# EAGLE board axoloti core v3 (EAGLE 6.2), part 1 of 2
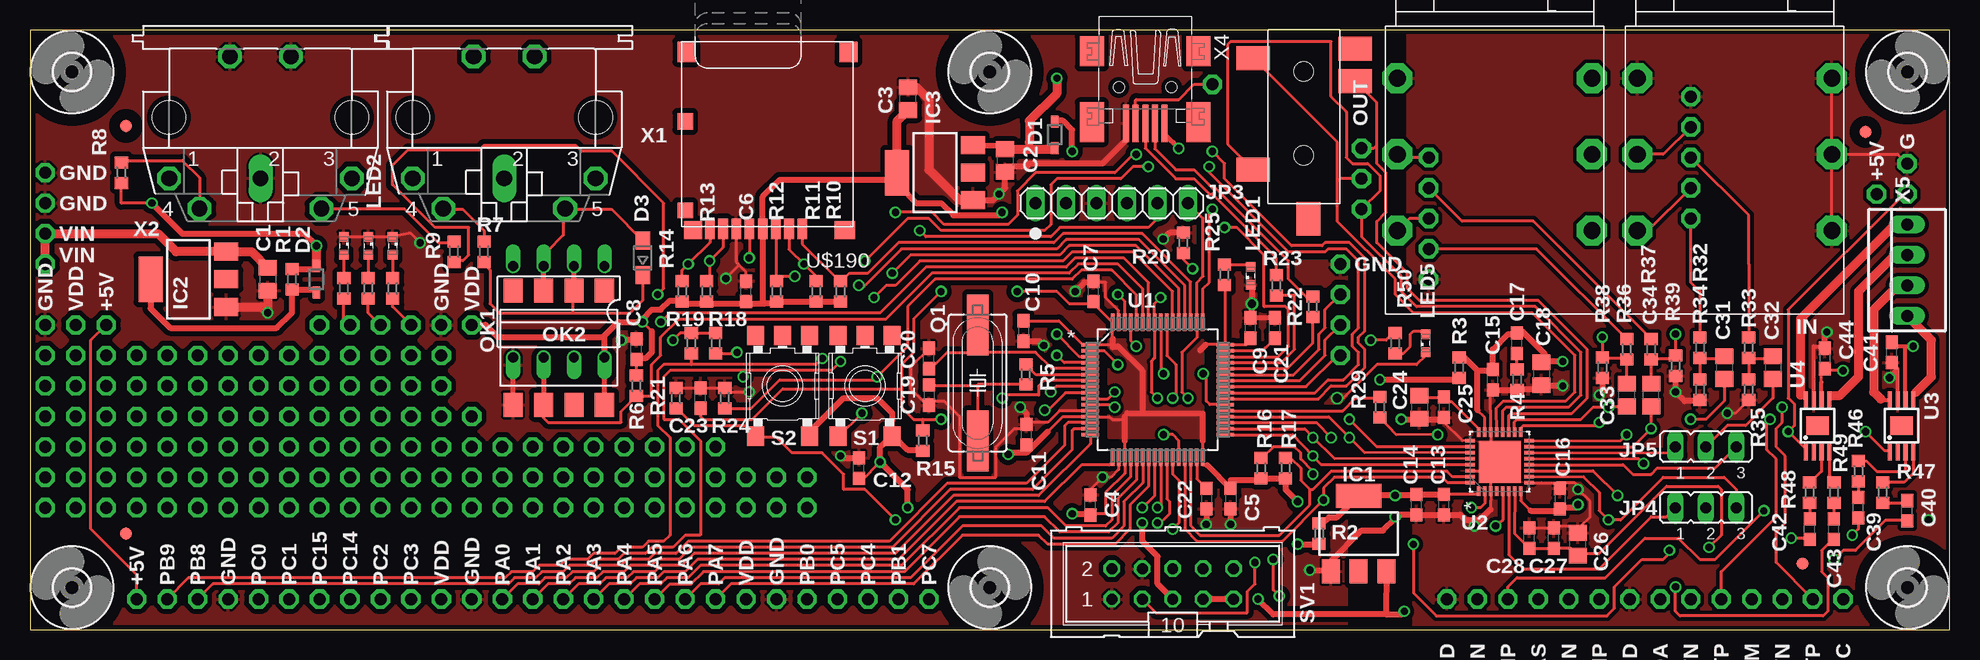
[diagram p5: board, top side]
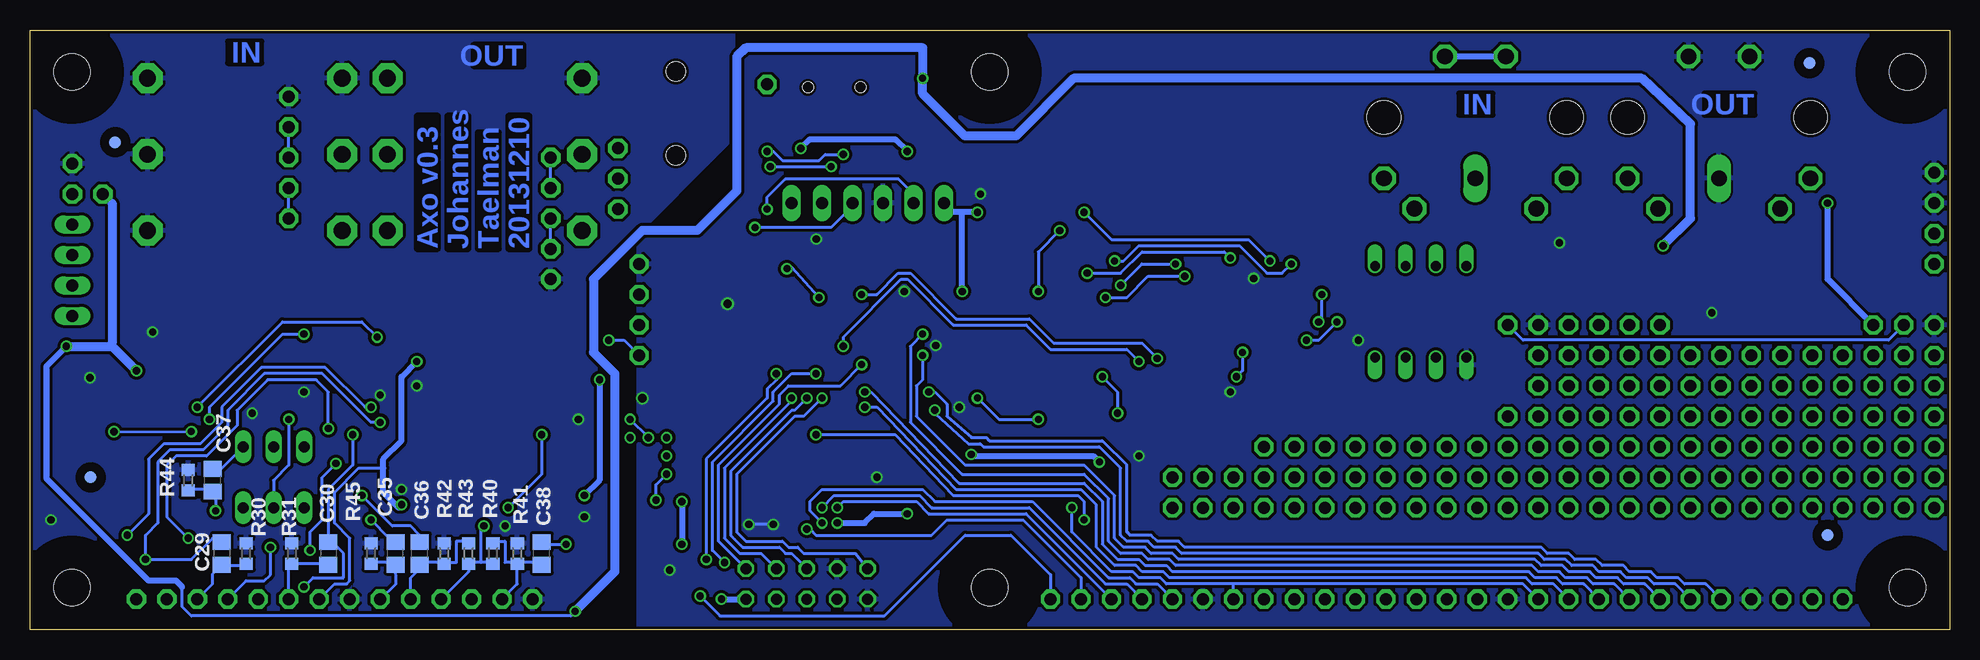
[diagram p6: board, bottom side, seen from below]

Size 160 x 50 mm. Coordinates in mm from the lower left corner, seen from the top.
Outline: 160,0 160,50 0,50 0,0 160,0
Copper layers (1*16): Top 0.018mm / dielectric 1.55mm / Bottom 0.018mm
Design rules: minimum track width 0.15mm, minimum drill 0.35mm, track to track 0.15mm, track to pad 0.15mm, pad to pad 0.15mm, via to via 0.15mm, smd to smd 0mil, copper to edge 0.25mm, drill to drill 0.35mm, minimum pad ring 0.175mm, minimum via ring 0.125mm, stop-mask expansion 0mil, vias tented up to drill 0.45mm, thermal gap 0.2mm

## Footprints (pad centres in the part's own frame; a part is rotated, then mirrored left to right if it is on the bottom)
C0805 = smd 1.3 x 1.5: 1 -0.95,0; 2 0.95,0
C0603 = smd 1.1 x 1: 1 -0.85,0; 2 0.85,0
SOD323 = smd 1 x 0.6: 1 -1.1,0; 2 1.1,0
SOD323-W = smd 1.5 x 1.2: A 1.45,0; C -1.45,0
3,0 = hole 3: 0,0
SOT223 = smd 1.5 x 2: 1 -2.3,-3.15; 2 0,-3.15; 3 2.3,-3.15 | smd 3.8 x 2: 4 0,3.15
1X06 = drill 1.016 long: 1 -6.35,0; 2 -3.81,0; 3 -1.27,0; 4 1.27,0; 5 3.81,0; 6 6.35,0
JP2 = drill 0.914 long: 1 -2.54,0; 2 0,0; 3 2.54,0
SML0603 = smd 0.8 x 0.8: A 0.75,0; C -0.75,0
DIL08 = drill 0.813 offset: 1 -3.81,-3.81; 2 -1.27,-3.81; 3 1.27,-3.81; 4 3.81,-3.81; 5 3.81,3.81; 6 1.27,3.81; 7 -1.27,3.81; 8 -3.81,3.81
DIL8-SMD = smd 1.6 x 2: 1 -3.81,-4.77; 2 -1.27,-4.77; 3 1.27,-4.77; 4 3.81,-4.77; 5 3.81,4.77; 6 1.27,4.77; 7 -1.27,4.77; 8 -3.81,4.77
SM49 = smd 5.08 x 1.778: 1 -4.826,0; 2 4.826,0
R0603 = smd 1 x 1.1: 1 -0.85,0; 2 0.85,0
SKHMPXE010 = smd 1.6 x 1.4: 1 -4.2,2.25; 2 4.2,2.25; 3 -4.2,-2.25; 4 4.2,-2.25; 5 4.2,0
ML10 = drill 0.914 octagon: 1 -5.08,-1.27; 2 -5.08,1.27; 3 -2.54,-1.27; 4 -2.54,1.27; 5 0,-1.27; 6 0,1.27; 7 2.54,-1.27; 8 2.54,1.27; 9 5.08,-1.27; 10 5.08,1.27
QFP50P1200X1200X160-64N = smd 1.473 x 0.279: 1 -5.613,3.759; 2 -5.613,3.251; 3 -5.613,2.743; 4 -5.613,2.261; 5 -5.613,1.753; 6 -5.613,1.245; 7 -5.613,0.762; 8 -5.613,0.254; 9 -5.613,-0.254; 10 -5.613,-0.762; 11 -5.613,-1.245; 12 -5.613,-1.753; 13 -5.613,-2.261; 14 -5.613,-2.743; 15 -5.613,-3.251; 16 -5.613,-3.759; 33 5.613,-3.759; 34 5.613,-3.251; 35 5.613,-2.743; 36 5.613,-2.261; 37 5.613,-1.753; 38 5.613,-1.245; 39 5.613,-0.762; 40 5.613,-0.254; 41 5.613,0.254; 42 5.613,0.762; 43 5.613,1.245; 44 5.613,1.753; 45 5.613,2.261; 46 5.613,2.743; 47 5.613,3.251; 48 5.613,3.759 | smd 0.279 x 1.473: 17 -3.759,-5.613; 18 -3.251,-5.613; 19 -2.743,-5.613; 20 -2.261,-5.613; 21 -1.753,-5.613; 22 -1.245,-5.613; 23 -0.762,-5.613; 24 -0.254,-5.613; 25 0.254,-5.613; 26 0.762,-5.613; 27 1.245,-5.613; 28 1.753,-5.613; 29 2.261,-5.613; 30 2.743,-5.613; 31 3.251,-5.613; 32 3.759,-5.613; 49 3.759,5.613; 50 3.251,5.613; 51 2.743,5.613; 52 2.261,5.613; 53 1.753,5.613; 54 1.245,5.613; 55 0.762,5.613; 56 0.254,5.613; 57 -0.254,5.613; 58 -0.762,5.613; 59 -1.245,5.613; 60 -1.753,5.613; 61 -2.261,5.613; 62 -2.743,5.613; 63 -3.251,5.613; 64 -3.759,5.613
QFN50P500X500X100-33N = smd 0.813 x 0.29: 1 -2.45,1.75; 2 -2.45,1.25; 3 -2.45,0.75; 4 -2.45,0.25; 5 -2.45,-0.25; 6 -2.45,-0.75; 7 -2.45,-1.25; 8 -2.45,-1.75; 17 2.45,-1.75; 18 2.45,-1.25; 19 2.45,-0.75; 20 2.45,-0.25; 21 2.45,0.25; 22 2.45,0.75; 23 2.45,1.25; 24 2.45,1.75 | smd 0.29 x 0.813: 9 -1.75,-2.45; 10 -1.25,-2.45; 11 -0.75,-2.45; 12 -0.25,-2.45; 13 0.25,-2.45; 14 0.75,-2.45; 15 1.25,-2.45; 16 1.75,-2.45; 25 1.75,2.45; 26 1.25,2.45; 27 0.75,2.45; 28 0.25,2.45; 29 -0.25,2.45; 30 -0.75,2.45; 31 -1.25,2.45; 32 -1.75,2.45 | smd 3.5 x 3.5: 33 0,0
MSOP8 = smd 0.35 x 1.55: 1 -0.975,-2.1; 2 -0.325,-2.1; 3 0.325,-2.1; 4 0.975,-2.1; 5 0.975,2.1; 6 0.325,2.1; 7 -0.325,2.1; 8 -0.975,2.1 | smd 1.89 x 1.57: 9 0,0
PROTOHOLE_NAMED = drill 1 pad 1.6 octagon: P$1 0,0
PROTOHOLE = drill 1 pad 1.6 octagon: P$1 0,0
JACK63 = drill 1.4 pad 2.5 octagon: R -10.7,8.115; RN -10.7,-8.115; S -4.35,8.115; SN -4.35,-8.115; T -17.05,8.115; TN -17.05,-8.115
FIDUCIAL-1 = smd 1 x 1: P$1 0,0
MOLEX_502774 = smd 0.8 x 1.68: 1 -2.9,15.61; 2 -1.8,15.61; 3 -0.7,15.61; 4 0.4,15.61; 5 1.5,15.61; 6 2.6,15.61; 7 3.7,15.61; 8 4.8,15.61 | smd 1.7 x 1.5: 10 -6.45,15.7 | smd 1.5 x 1.7: 11 6.75,0.85; 12 -6.75,0.85 | smd 1.5 x 1.5: 15 6.2,15.7 | smd 1.29 x 1.3: CD1 6.855,14.05 | smd 1.29 x 1.4: CD2 6.855,6.65
35RASMT4BHNTR = smd 2 x 2.8: P1 2.4,-4.2; P2 4.3,4.3; P3 11.7,-4.2; P4 1.6,4.3 | smd 2.8 x 2: P5 15.8,0.4 | hole 1.6: 3.5,0; 10.5,0
MAB5SH = drill 1.321 octagon: 1 7.62,5.08; 3 -7.62,5.08; 4 5.08,7.62; 5 -5.08,7.62; PE -2.54,-5.08; PE@ 2.54,-5.08 | drill 1.321 long: 2 0,5.08 | hole 2.794: 7.62,0; -7.62,0
32005-301 = smd 3.1 x 0.5: 1 3,1.6; 2 3,0.8; 3 3,0; 4 3,-0.8; 5 3,-1.6 | smd 2.5 x 2: M1 -3,-4.45; M2 -3,4.45 | smd 3.3 x 2: M3 2.9,4.45; M4 2.9,-4.45 | hole 0.9: 0,2.2; 0,-2.2
22-23-2041 = drill 1 long: 1 -3.81,0; 2 -1.27,0; 3 1.27,0; 4 3.81,0

## Placement (x,y rotation side)
C1  10u  [C0805]  19.81,29.21 270 top
C2  10u  [C0805]  81.28,39.12 270 top
C3  10u  [C0805]  73.19,44.26 90 top
C4  100n  [C0603]  88.39,10.39 90 top
C5  100n  [C0603]  100.08,10.92 270 top
C6  100n  [C0603]  59.69,28.19 90 top
C7  100n  [C0603]  88.65,28.19 90 top
C8  100n  [C0603]  50.55,23.37 90 top
C9  100n  [C0603]  101.73,25.15 90 top
C10  100n  [C0603]  82.8,24.89 270 top
C11  100n  [C0603]  83.06,16.26 90 top
C12  100n  [C0603]  69.09,13.46 90 top
C13  100n  [C0603]  117.86,10.41 90 top
C14  100n  [C0603]  115.57,10.41 90 top
C15  100n  [C0603]  121.92,20.83 90 top
C16  100n  [C0603]  127.51,10.92 270 top
C17  9.1p  [C0603]  123.95,23.88 90 top
C18  10u  [C0805]  125.98,21.34 270 top
C19  27p  [C0603]  74.93,19.56 270 top
C20  27p  [C0603]  74.93,22.61 90 top
C21  2u2  [C0603]  103.76,25.15 90 top
C22  2u2  [C0603]  98.04,10.92 270 top
C23  100n  [C0603]  55.88,19.3 90 top
C24  10u  [C0805]  115.82,18.54 270 top
C25  100n  [C0603]  117.86,18.54 270 top
C26  10u  [C0805]  129.03,7.11 90 top
C27  100n  [C0603]  127,7.62 90 top
C28  100n  [C0603]  124.97,7.62 90 top
C29  NC  [C0805]  144.02,6.35 270 bottom
C30  NC  [C0805]  135.13,6.35 270 bottom
C31  10u  [C0805]  141.22,21.84 270 top
C32  10u  [C0805]  145.29,21.84 270 top
C33  10u  [C0805]  133.1,19.56 90 top
C34  10u  [C0805]  135.13,19.56 90 top
C35  NC  [C0805]  129.54,6.35 90 bottom
C36  NC  [C0805]  127.51,6.35 90 bottom
C37  NC  [C0805]  144.78,12.45 90 bottom
C38  NC  [C0805]  117.35,6.35 90 bottom
C39  NC  [C0603]  152.4,10.16 90 top
C40  NC  [C0603]  156.46,9.91 90 top
C41  NC  [C0603]  155.19,23.11 90 top
C42  NC  [C0603]  148.34,8.38 90 top
C43  NC  [C0603]  150.37,8.38 90 top
C44  NC  [C0603]  149.61,22.61 270 top
D1  schottky 500mA  [SOD323]  85.42,41.26 90 top
D2  schottky 500mA  [SOD323]  23.88,29.21 270 top
D3  1N4148  [SOD323-W]  51.07,31 90 top
H1  MOUNT-HOLE3.0  [3,0]  3.5,3.5 90 top
H2  MOUNT-HOLE3.0  [3,0]  3.5,46.5 90 top
H3  MOUNT-HOLE3.0  [3,0]  80,46.5 90 top
H4  MOUNT-HOLE3.0  [3,0]  156.5,3.5 90 top
H5  MOUNT-HOLE3.0  [3,0]  80,3.5 0 top
H6  MOUNT-HOLE3.0  [3,0]  156.5,46.5 0 top
IC1  LD117AS33TR  [SOT223]  110.74,8 0 top
IC2  LD117AS50TR  [SOT223]  13.21,29.21 90 top
IC3  LD117AS33TR  [SOT223]  75.44,38.1 90 top
JP3  [1X06]  90.17,35.56 0 top
JP4  [JP2]  139.7,10.16 0 top
JP5  [JP2]  139.7,15.24 0 top
LED1  [SML0603]  101.77,29.5 90 top
LED2  [SML0603]  30.23,32 270 top
LED3  [SML0603]  28.19,32 270 top
LED4  [SML0603]  26.16,32 270 top
LED5  [SML0603]  116.33,23.88 90 top
OK1  6N137  [DIL08]  44.07,26.5 180 top
OK2  6N137SMD  [DIL8-SMD]  44.07,23.5 180 top
Q1  [SM49]  78.99,20.57 90 top
R1  0  [R0603]  21.84,29.21 270 top
R2  NC  [R0603]  107.44,8 270 top
R3  0  [R0603]  119.13,21.84 270 top
R4  1.2nH  [R0603]  123.95,20.83 270 top
R5  220  [R0603]  83.02,21.27 90 top
R6  NC  [R0603]  50.55,20.32 270 top
R7  220  [R0603]  37.85,31.51 90 top
R8  220  [R0603]  7.62,38.1 90 top
R9  220  [R0603]  35.35,31.51 270 top
R10  47k  [R0603]  67.56,28.19 270 top
R11  47k  [R0603]  65.53,28.19 270 top
R12  47k  [R0603]  62.23,28.19 270 top
R13  47k  [R0603]  56.39,28.19 270 top
R14  47k  [R0603]  54.36,28.19 270 top
R15  nc  [R0603]  74.42,15.75 90 top
R16  4k7  [R0603]  102.62,13.46 90 top
R17  4k7  [R0603]  104.65,13.46 90 top
R18  NC  [R0603]  57.15,23.88 270 top
R19  NC  [R0603]  55.12,23.88 270 top
R20  47k  [R0603]  96.14,32.25 270 top
R21  47k  [R0603]  53.85,19.3 270 top
R22  22  [R0603]  106.93,26.92 270 top
R23  22  [R0603]  103.89,28.7 270 top
R24  47k  [R0603]  57.91,19.3 270 top
R25  220  [R0603]  99.55,29.59 90 top
R26  220  [R0603]  30.23,28.45 90 top
R27  220  [R0603]  28.19,28.45 90 top
R28  220  [R0603]  26.16,28.45 90 top
R29  50  [R0603]  112.52,18.54 90 top
R30  NC  [R0603]  141.99,6.35 270 bottom
R31  NC  [R0603]  138.18,6.35 270 bottom
R32  4k7  [R0603]  139.19,23.5 90 top
R33  4k7  [R0603]  143.25,23.5 90 top
R34  47k  [R0603]  139.19,20 90 top
R35  47k  [R0603]  143.25,20 90 top
R36  220  [R0603]  133.1,23.37 270 top
R37  220  [R0603]  135.13,23.37 270 top
R38  47k  [R0603]  131.06,21.84 90 top
R39  47k  [R0603]  137.16,22 90 top
R40  NC  [R0603]  121.41,6.35 90 bottom
R41  NC  [R0603]  119.38,6.35 270 bottom
R42  NC  [R0603]  125.48,6.35 270 bottom
R43  NC  [R0603]  123.44,6.35 90 bottom
R44  NC  [R0603]  146.81,12.45 270 bottom
R45  NC  [R0603]  131.57,6.35 270 bottom
R46  NC  [R0603]  152.4,13.21 270 top
R47  NC  [R0603]  154.43,11.43 270 top
R48  NC  [R0603]  148.34,11.43 270 top
R49  NC  [R0603]  150.37,11.43 270 top
R50  220  [R0603]  113.79,23.88 270 top
S1  SKHMPSE010  [SKHMPXE010]  69.6,20.32 90 top
S2  SKHMPSE010  [SKHMPXE010]  62.74,20.32 90 top
SV1  [ML10]  95.25,3.81 0 top
U1  STM32F405RGT6  [QFP50P1200X1200X160-64N]  94,20 0 top
U2  ADAU1961WBCPZ  [QFN50P500X500X100-33N]  122.5,14 90 top
U3  NC (TPA2005D1DRBRMSOP8)  [MSOP8]  156,17 0 top
U4  NC (TPA2005D1DRBRMSOP8)  [MSOP8]  149,17 0 top
U$1  +5V  [PROTOHOLE_NAMED]  8.89,2.54 90 top
U$2  PROTOHOLE  [PROTOHOLE]  31.75,25.4 0 top
U$3  PROTOHOLE  [PROTOHOLE]  29.21,25.4 0 top
U$4  PROTOHOLE  [PROTOHOLE]  26.67,25.4 0 top
U$5  JACK63  [JACK63]  142.09,50.33 90 top
U$6  JACK63  [JACK63]  122.09,50.33 90 top
U$7  NC  [PROTOHOLE_NAMED]  151.13,2.54 270 top
U$8  VDDA  [PROTOHOLE_NAMED]  135.89,2.54 270 top
U$9  ALOUTP  [PROTOHOLE_NAMED]  148.59,2.54 270 top
U$10  ALOUTN  [PROTOHOLE_NAMED]  146.05,2.54 270 top
U$11  CM  [PROTOHOLE_NAMED]  143.51,2.54 270 top
U$12  AROUTP  [PROTOHOLE_NAMED]  140.97,2.54 270 top
U$13  AROUTN  [PROTOHOLE_NAMED]  138.43,2.54 270 top
U$14  GND  [PROTOHOLE_NAMED]  133.35,2.54 270 top
U$15  LINP  [PROTOHOLE_NAMED]  130.81,2.54 270 top
U$16  LINN  [PROTOHOLE_NAMED]  128.27,2.54 270 top
U$17  MICBIAS  [PROTOHOLE_NAMED]  125.73,2.54 270 top
U$18  RINP  [PROTOHOLE_NAMED]  123.19,2.54 270 top
U$19  RINN  [PROTOHOLE_NAMED]  120.65,2.54 270 top
U$20  GND  [PROTOHOLE_NAMED]  118.11,2.54 270 top
U$21  PC14  [PROTOHOLE_NAMED]  26.67,2.54 90 top
U$22  PC15  [PROTOHOLE_NAMED]  24.13,2.54 90 top
U$23  PC0  [PROTOHOLE_NAMED]  19.05,2.54 90 top
U$24  PC1  [PROTOHOLE_NAMED]  21.59,2.54 90 top
U$25  PC2  [PROTOHOLE_NAMED]  29.21,2.54 90 top
U$26  PC3  [PROTOHOLE_NAMED]  31.75,2.54 90 top
U$27  PC7  [PROTOHOLE_NAMED]  74.93,2.54 90 top
U$28  PB1  [PROTOHOLE_NAMED]  72.39,2.54 90 top
U$29  PC4  [PROTOHOLE_NAMED]  69.85,2.54 90 top
U$30  PC5  [PROTOHOLE_NAMED]  67.31,2.54 90 top
U$31  PB8  [PROTOHOLE_NAMED]  13.97,2.54 90 top
U$32  PB0  [PROTOHOLE_NAMED]  64.77,2.54 90 top
U$33  PB9  [PROTOHOLE_NAMED]  11.43,2.54 90 top
U$34  GND  [PROTOHOLE_NAMED]  62.23,2.54 90 top
U$35  PA7  [PROTOHOLE_NAMED]  57.15,2.54 90 top
U$36  VDD  [PROTOHOLE_NAMED]  59.69,2.54 90 top
U$37  PA6  [PROTOHOLE_NAMED]  54.61,2.54 90 top
U$38  PA5  [PROTOHOLE_NAMED]  52.07,2.54 90 top
U$39  PA4  [PROTOHOLE_NAMED]  49.53,2.54 90 top
U$40  PA3  [PROTOHOLE_NAMED]  46.99,2.54 90 top
U$41  PA2  [PROTOHOLE_NAMED]  44.45,2.54 90 top
U$42  PA1  [PROTOHOLE_NAMED]  41.91,2.54 90 top
U$43  PA0  [PROTOHOLE_NAMED]  39.37,2.54 90 top
U$44  VDD  [PROTOHOLE_NAMED]  34.29,2.54 90 top
U$45  VDD  [PROTOHOLE_NAMED]  36.83,25.4 90 top
U$46  VDD  [PROTOHOLE_NAMED]  3.81,25.4 90 top
U$47  GND  [PROTOHOLE_NAMED]  36.83,2.54 90 top
U$48  GND  [PROTOHOLE_NAMED]  16.51,2.54 90 top
U$49  GND  [PROTOHOLE_NAMED]  34.29,25.4 90 top
U$50  +5V  [PROTOHOLE_NAMED]  6.35,25.4 90 top
U$51  GND  [PROTOHOLE_NAMED]  1.27,25.4 90 top
U$52  FIDUCIAL-1  [FIDUCIAL-1]  8,42 0 top
U$53  FIDUCIAL-1  [FIDUCIAL-1]  8,8 0 top
U$54  FIDUCIAL-1  [FIDUCIAL-1]  153,41.5 0 top
U$55  FIDUCIAL-1  [FIDUCIAL-1]  147.74,5.5 0 top
U$56  PROTOHOLE  [PROTOHOLE]  8.89,22.86 0 top
U$57  PROTOHOLE  [PROTOHOLE]  24.13,10.16 0 top
U$58  PROTOHOLE  [PROTOHOLE]  29.21,15.24 0 top
U$59  PROTOHOLE  [PROTOHOLE]  6.35,10.16 0 top
U$60  PROTOHOLE  [PROTOHOLE]  11.43,22.86 0 top
U$61  PROTOHOLE  [PROTOHOLE]  24.13,12.7 0 top
U$62  PROTOHOLE  [PROTOHOLE]  31.75,15.24 0 top
U$63  PROTOHOLE  [PROTOHOLE]  3.81,12.7 90 top
U$64  PROTOHOLE  [PROTOHOLE]  19.05,22.86 0 top
U$65  PROTOHOLE  [PROTOHOLE]  24.13,15.24 0 top
U$66  PROTOHOLE  [PROTOHOLE]  34.29,15.24 0 top
U$67  PROTOHOLE  [PROTOHOLE]  3.81,15.24 90 top
U$68  PROTOHOLE  [PROTOHOLE]  24.13,17.78 0 top
U$69  PROTOHOLE  [PROTOHOLE]  26.67,10.16 0 top
U$70  PROTOHOLE  [PROTOHOLE]  36.83,15.24 0 top
U$71  PROTOHOLE  [PROTOHOLE]  3.81,17.78 90 top
U$72  PROTOHOLE  [PROTOHOLE]  26.67,17.78 0 top
U$73  PROTOHOLE  [PROTOHOLE]  26.67,12.7 0 top
U$74  PROTOHOLE  [PROTOHOLE]  39.37,15.24 0 top
U$75  PROTOHOLE  [PROTOHOLE]  3.81,20.32 90 top
U$76  PROTOHOLE  [PROTOHOLE]  29.21,17.78 0 top
U$77  PROTOHOLE  [PROTOHOLE]  26.67,15.24 0 top
U$78  PROTOHOLE  [PROTOHOLE]  41.91,15.24 0 top
U$79  PROTOHOLE  [PROTOHOLE]  3.81,22.86 90 top
U$80  PROTOHOLE  [PROTOHOLE]  13.97,22.86 0 top
U$81  PROTOHOLE  [PROTOHOLE]  19.05,15.24 0 top
U$82  PROTOHOLE  [PROTOHOLE]  29.21,12.7 0 top
U$83  PROTOHOLE  [PROTOHOLE]  1.27,12.7 0 top
U$84  PROTOHOLE  [PROTOHOLE]  16.51,22.86 0 top
U$85  PROTOHOLE  [PROTOHOLE]  21.59,15.24 0 top
U$86  PROTOHOLE  [PROTOHOLE]  31.75,12.7 0 top
U$87  PROTOHOLE  [PROTOHOLE]  6.35,12.7 90 top
U$88  PROTOHOLE  [PROTOHOLE]  31.75,17.78 0 top
U$89  PROTOHOLE  [PROTOHOLE]  19.05,12.7 0 top
U$90  PROTOHOLE  [PROTOHOLE]  34.29,12.7 0 top
U$91  PROTOHOLE  [PROTOHOLE]  6.35,15.24 90 top
U$92  PROTOHOLE  [PROTOHOLE]  49.53,12.7 0 top
U$93  PROTOHOLE  [PROTOHOLE]  21.59,12.7 0 top
U$94  PROTOHOLE  [PROTOHOLE]  36.83,12.7 0 top
U$95  PROTOHOLE  [PROTOHOLE]  6.35,17.78 90 top
U$96  PROTOHOLE  [PROTOHOLE]  49.53,10.16 0 top
U$97  PROTOHOLE  [PROTOHOLE]  19.05,10.16 0 top
U$98  PROTOHOLE  [PROTOHOLE]  39.37,12.7 0 top
U$99  PROTOHOLE  [PROTOHOLE]  6.35,20.32 90 top
U$100  PROTOHOLE  [PROTOHOLE]  49.53,15.24 0 top
U$101  PROTOHOLE  [PROTOHOLE]  21.59,10.16 0 top
U$102  PROTOHOLE  [PROTOHOLE]  41.91,12.7 0 top
U$103  PROTOHOLE  [PROTOHOLE]  6.35,22.86 90 top
U$104  PROTOHOLE  [PROTOHOLE]  21.59,17.78 0 top
U$105  PROTOHOLE  [PROTOHOLE]  8.89,15.24 0 top
U$106  PROTOHOLE  [PROTOHOLE]  29.21,10.16 0 top
U$107  PROTOHOLE  [PROTOHOLE]  1.27,10.16 0 top
U$108  PROTOHOLE  [PROTOHOLE]  52.07,12.7 0 top
U$109  PROTOHOLE  [PROTOHOLE]  11.43,15.24 0 top
U$110  PROTOHOLE  [PROTOHOLE]  31.75,10.16 0 top
U$111  PROTOHOLE  [PROTOHOLE]  8.89,20.32 0 top
U$112  PROTOHOLE  [PROTOHOLE]  54.61,12.7 0 top
U$113  PROTOHOLE  [PROTOHOLE]  13.97,15.24 0 top
U$114  PROTOHOLE  [PROTOHOLE]  34.29,10.16 0 top
U$115  PROTOHOLE  [PROTOHOLE]  11.43,20.32 0 top
U$116  PROTOHOLE  [PROTOHOLE]  57.15,12.7 0 top
U$117  PROTOHOLE  [PROTOHOLE]  16.51,15.24 0 top
U$118  PROTOHOLE  [PROTOHOLE]  36.83,10.16 0 top
U$119  PROTOHOLE  [PROTOHOLE]  13.97,20.32 0 top
U$120  PROTOHOLE  [PROTOHOLE]  59.69,12.7 0 top
U$121  PROTOHOLE  [PROTOHOLE]  8.89,12.7 0 top
U$122  PROTOHOLE  [PROTOHOLE]  39.37,10.16 0 top
U$123  PROTOHOLE  [PROTOHOLE]  16.51,20.32 0 top
U$124  PROTOHOLE  [PROTOHOLE]  62.23,12.7 0 top
U$125  PROTOHOLE  [PROTOHOLE]  11.43,12.7 0 top
U$126  PROTOHOLE  [PROTOHOLE]  41.91,10.16 0 top
U$127  PROTOHOLE  [PROTOHOLE]  19.05,20.32 0 top
U$128  PROTOHOLE  [PROTOHOLE]  64.77,10.16 0 top
U$129  PROTOHOLE  [PROTOHOLE]  13.97,12.7 0 top
U$130  PROTOHOLE  [PROTOHOLE]  46.99,15.24 0 top
U$131  PROTOHOLE  [PROTOHOLE]  3.81,10.16 0 top
U$132  PROTOHOLE  [PROTOHOLE]  52.07,10.16 0 top
U$133  PROTOHOLE  [PROTOHOLE]  16.51,12.7 0 top
U$134  PROTOHOLE  [PROTOHOLE]  46.99,12.7 0 top
U$135  PROTOHOLE  [PROTOHOLE]  8.89,17.78 0 top
U$136  PROTOHOLE  [PROTOHOLE]  54.61,10.16 0 top
U$137  PROTOHOLE  [PROTOHOLE]  8.89,10.16 0 top
U$138  PROTOHOLE  [PROTOHOLE]  46.99,10.16 0 top
U$139  PROTOHOLE  [PROTOHOLE]  11.43,17.78 0 top
U$140  PROTOHOLE  [PROTOHOLE]  57.15,10.16 0 top
U$141  PROTOHOLE  [PROTOHOLE]  11.43,10.16 0 top
U$142  PROTOHOLE  [PROTOHOLE]  44.45,10.16 0 top
U$143  PROTOHOLE  [PROTOHOLE]  13.97,17.78 0 top
U$144  PROTOHOLE  [PROTOHOLE]  59.69,10.16 0 top
U$145  PROTOHOLE  [PROTOHOLE]  13.97,10.16 0 top
U$146  PROTOHOLE  [PROTOHOLE]  44.45,12.7 0 top
U$147  PROTOHOLE  [PROTOHOLE]  16.51,17.78 0 top
U$148  PROTOHOLE  [PROTOHOLE]  62.23,10.16 0 top
U$149  PROTOHOLE  [PROTOHOLE]  16.51,10.16 0 top
U$150  PROTOHOLE  [PROTOHOLE]  44.45,15.24 0 top
U$151  PROTOHOLE  [PROTOHOLE]  19.05,17.78 0 top
U$152  PROTOHOLE  [PROTOHOLE]  1.27,15.24 0 top
U$153  PROTOHOLE  [PROTOHOLE]  1.27,17.78 0 top
U$154  PROTOHOLE  [PROTOHOLE]  1.27,22.86 0 top
U$155  PROTOHOLE  [PROTOHOLE]  1.27,20.32 0 top
U$156  PROTOHOLE  [PROTOHOLE]  21.59,22.86 0 top
U$157  PROTOHOLE  [PROTOHOLE]  64.77,12.7 0 top
U$158  PROTOHOLE  [PROTOHOLE]  24.13,22.86 0 top
U$159  PROTOHOLE  [PROTOHOLE]  57.15,15.24 0 top
U$160  PROTOHOLE  [PROTOHOLE]  26.67,22.86 0 top
U$161  PROTOHOLE  [PROTOHOLE]  24.13,25.4 0 top
U$162  PROTOHOLE  [PROTOHOLE]  21.59,20.32 0 top
U$163  PROTOHOLE  [PROTOHOLE]  34.29,17.78 0 top
U$164  PROTOHOLE  [PROTOHOLE]  24.13,20.32 0 top
U$165  PROTOHOLE  [PROTOHOLE]  36.83,17.78 0 top
U$166  PROTOHOLE  [PROTOHOLE]  26.67,20.32 0 top
U$167  PROTOHOLE  [PROTOHOLE]  54.61,15.24 0 top
U$168  PROTOHOLE  [PROTOHOLE]  29.21,22.86 0 top
U$169  FIDUCIAL-1  [FIDUCIAL-1]  10.16,7.87 0 bottom
U$170  PROTOHOLE  [PROTOHOLE]  29.21,20.32 0 top
U$171  PROTOHOLE  [PROTOHOLE]  52.07,15.24 0 top
U$172  PROTOHOLE  [PROTOHOLE]  31.75,22.86 0 top
U$173  PROTOHOLE  [PROTOHOLE]  31.75,20.32 0 top
U$174  PROTOHOLE  [PROTOHOLE]  34.29,20.32 0 top
U$175  PROTOHOLE  [PROTOHOLE]  34.29,22.86 0 top
U$176  PROTOHOLE  [PROTOHOLE]  156.46,36.32 0 top
U$177  +5V  [PROTOHOLE_NAMED]  153.92,36.32 90 top
U$178  G  [PROTOHOLE_NAMED]  156.46,38.86 90 top
U$179  GND  [PROTOHOLE_NAMED]  1.27,38.1 0 top
U$180  GND  [PROTOHOLE_NAMED]  1.27,35.56 0 top
U$181  VIN  [PROTOHOLE_NAMED]  1.27,33.02 0 top
U$182  VIN  [PROTOHOLE_NAMED]  1.27,30.48 0 top
U$183  FIDUCIAL-1  [FIDUCIAL-1]  11.68,47.24 0 bottom
U$184  FIDUCIAL-1  [FIDUCIAL-1]  152.91,40.64 0 bottom
U$185  FIDUCIAL-1  [FIDUCIAL-1]  154.94,12.7 0 bottom
U$186  PROTOHOLE  [PROTOHOLE]  109.22,27.94 0 top
U$187  PROTOHOLE  [PROTOHOLE]  109.22,25.4 0 top
U$188  PROTOHOLE  [PROTOHOLE]  109.22,22.86 0 top
U$189  GND  [PROTOHOLE_NAMED]  109.22,30.48 0 top
U$190  MOLEX_502774  [MOLEX_502774]  61.47,49.02 180 top
U$191  35RASMT4  [35RASMT4BHNTR]  106.17,50.04 270 top
U$192  PROTOHOLE  [PROTOHOLE]  111,37.59 0 top
U$193  PROTOHOLE  [PROTOHOLE]  111,35.05 0 top
U$194  PROTOHOLE  [PROTOHOLE]  111,40.13 0 top
U$195  PROTOHOLE  [PROTOHOLE]  98.55,45.47 0 top
U$196  PROTOHOLE  [PROTOHOLE]  138.43,44.45 0 top
U$197  PROTOHOLE  [PROTOHOLE]  138.43,41.91 0 top
U$198  PROTOHOLE  [PROTOHOLE]  138.43,39.37 0 top
U$199  PROTOHOLE  [PROTOHOLE]  138.43,36.83 0 top
U$200  PROTOHOLE  [PROTOHOLE]  138.43,34.29 0 top
U$201  PROTOHOLE  [PROTOHOLE]  116.59,34.29 0 top
U$202  PROTOHOLE  [PROTOHOLE]  116.59,31.75 0 top
U$203  PROTOHOLE  [PROTOHOLE]  116.59,39.37 0 top
U$204  PROTOHOLE  [PROTOHOLE]  116.59,36.83 0 top
U$205  PROTOHOLE  [PROTOHOLE]  116.59,29.21 0 top
X1  MAB5SH  [MAB5SH]  39.53,42.71 180 top
X2  MAB5SH  [MAB5SH]  19.21,42.71 180 top
X4  MINI-USB-32005-301  [32005-301]  92.96,45.21 270 top
X5  22-23-2041  [22-23-2041]  156.46,29.97 90 top